# Altium schematic sheet Digital ISO.SchDoc
size A4; SheetNumber: 5; SheetTotal: 5
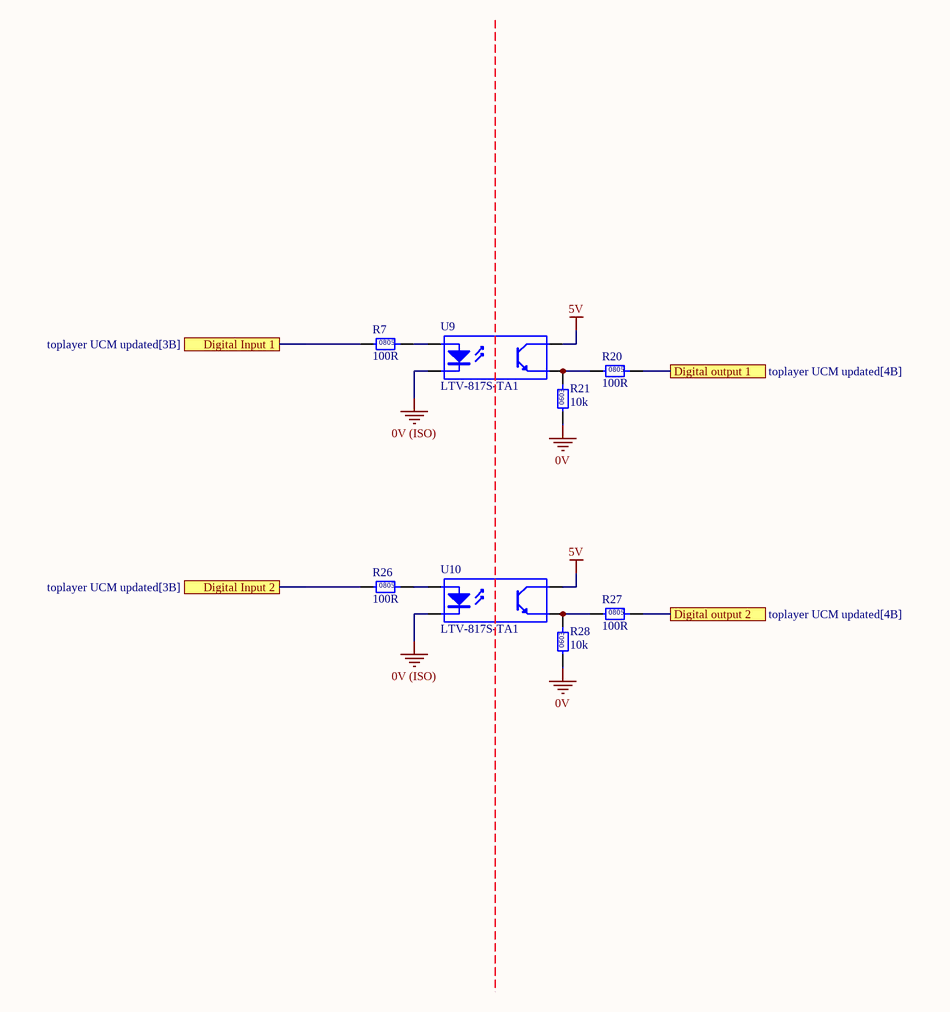
[diagram p0: Digital ISO.SchDoc]

## Parts
R7  100R  [0805]
R20  100R  [0805]
R21  10k  [0603]
R26  100R  [0805]
R27  100R  [0805]
R28  10k  [0603]
U9  LTV-817S-TA1  [ON 4-SMD]
U10  LTV-817S-TA1  [ON 4-SMD]

## Ports
Digital Input 1 (see toplayer UCM updated[3B]), Digital Input 2 (see toplayer UCM updated[3B]), Digital output 1 (see toplayer UCM updated[4B]), Digital output 2 (see toplayer UCM updated[4B])

## Nets
0V: R21.1 R28.1
0V (ISO): U9.2(K) U10.2(K)
5V: U9.4(C) U10.4(C)
Digital Input 1: R7.1 ; port Digital Input 1
Digital Input 2: R26.1 ; port Digital Input 2
Digital output 1: R20.2 ; port Digital output 1
Digital output 2: R27.2 ; port Digital output 2
NetR7_2: R7.2 U9.1(A)
NetR20_1: R20.1 R21.2 U9.3(E)
NetR26_2: R26.2 U10.1(A)
NetR27_1: R27.1 R28.2 U10.3(E)

## Notes on the sheet
- (in symbol RC0603FR-0710KL) 0603
- (in symbol RC0805FR07100RL) 0805

## Library data of the parts
R7 R20 R26 R27 = RC0805FR07100RL: Manufacturer: YAGEO; Tolerance: 0.01; Rated Power: 0.125W; Part Number: RC0805FR07100RL; Value: 100R; Material: FR-07; Digikey Part Number: 311-100CRCT-ND
R21 R28 = RC0603FR-0710KL: Manufacturer: YAGEO; Tolerance: 0.01; Rated Power: 0.1W; Part Number: RC0603FR-0710KL; Value: 10k; Material: FR-07; Digikey Part Number: 311-10.0KHRCT-ND
U9 U10 = LTV-817S-TA1: 35V 50ma Optocoupler (VF=1.2V); Manufacturer: Lite-On Inc; Part Number: LTV-817S-TA1; Digikey Part Number: 160-1893-2-ND; Digikey Link: https://www.digikey.com/product-detail/en/lite-on-inc/LTV-817S-TA1/160-1893-2-ND/388451